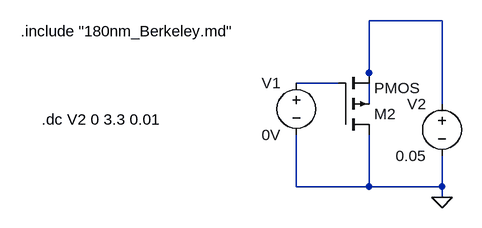
[diagram p0: schematic PMOS_Characteristics.asc]
PMOS_Characteristics.asc, the LTspice schematic file:
Version 4
SHEET 1 980 680
WIRE 912 -32 800 -32
WIRE 800 48 800 -32
WIRE 752 64 688 64
WIRE 800 96 800 48
WIRE 912 96 912 -32
WIRE 688 224 688 144
WIRE 800 224 800 144
WIRE 800 224 688 224
WIRE 912 224 912 176
WIRE 912 224 800 224
WIRE 912 240 912 224
FLAG 912 240 0
SYMBOL voltage 688 48 M0
WINDOW 123 0 0 Left 2
WINDOW 39 0 0 Left 2
SYMATTR InstName V1
SYMATTR Value 0V
SYMBOL voltage 912 80 M0
WINDOW 123 0 0 Left 2
WINDOW 39 0 0 Left 2
SYMATTR InstName V2
SYMATTR Value 0.05
SYMBOL pmos4 752 144 M180
SYMATTR InstName M2
SYMATTR Value2 l=180nm w=540nm
TEXT 264 -16 Left 2 !.include "180nm_Berkeley.md"
TEXT 296 120 Left 2 !.dc V2 0 3.3 0.01

The netlist it stands for:
* PMOS_Characteristics.asc
V1 N002 0 0V
V2 N001 0 0.05
M2 0 N002 N001 N001 PMOS l=180nm w=540nm
.model NMOS NMOS
.model PMOS PMOS
.lib standard.mos
.include "180nm_Berkeley.md"
.dc V2 0 3.3 0.01
.backanno
.end